# Altium schematic sheet PWM.SchDoc
size 420 x 297 mm; SheetNumber: 6; SheetTotal: 7
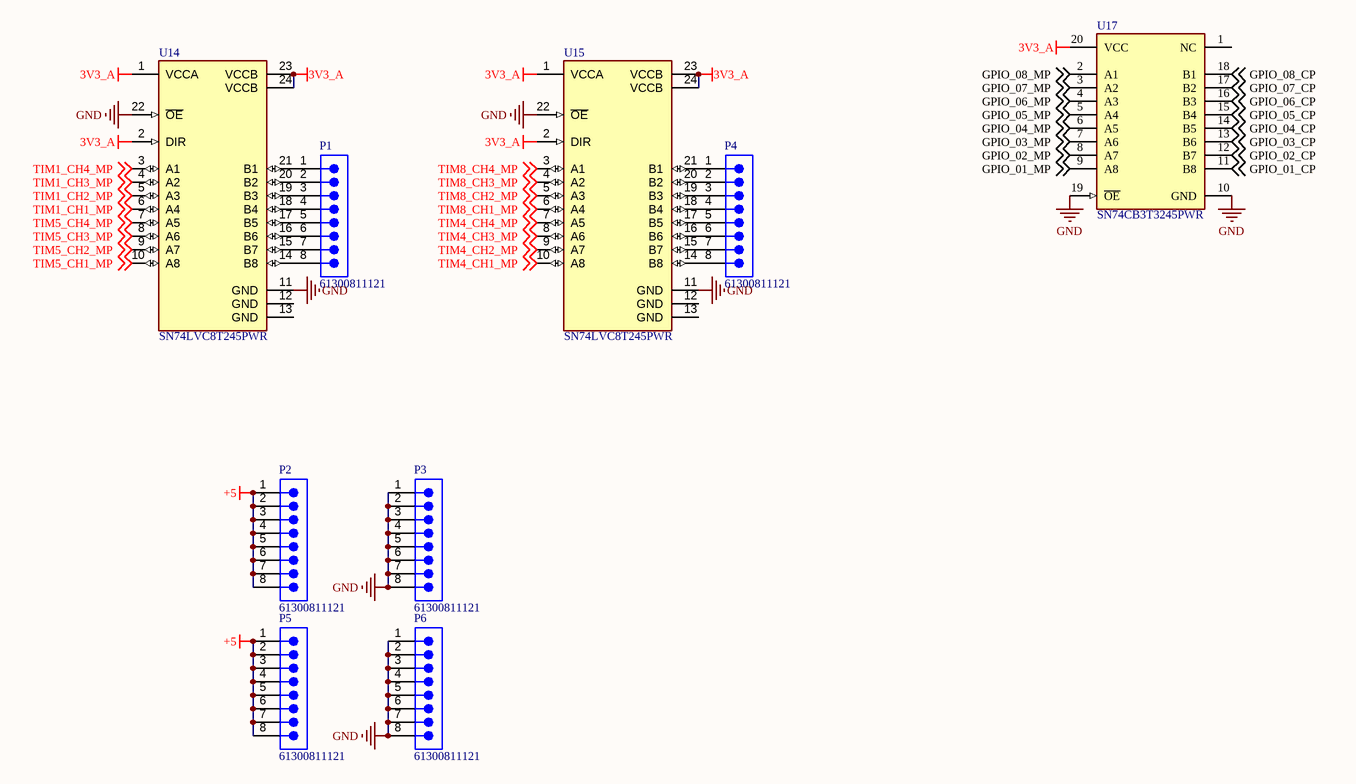
[diagram p0: PWM.SchDoc]

## Parts
P1  61300811121  [61300811121]
P2  61300811121  [61300811121]
P3  61300811121  [61300811121]
P4  61300811121  [61300811121]
P5  61300811121  [61300811121]
P6  61300811121  [61300811121]
U14  SN74LVC8T245PWR  [FP-PW0024A-MFG]
U15  SN74LVC8T245PWR  [FP-PW0024A-MFG]
U17  SN74CB3T3245PWR  [FP-PW0020A-MFG]

## Nets
3V3_A: U14.1(VCCA) U14.2(DIR) U14.23(VCCB) U14.24(VCCB) U15.1(VCCA) U15.2(DIR) U15.23(VCCB) U15.24(VCCB) U17.20(VCC)
+5: P2.1 P2.2 P2.3 P2.4 P2.5 P2.6 P2.7 P2.8 P5.1 P5.2 P5.3 P5.4 P5.5 P5.6 P5.7 P5.8
GND: P3.1 P3.2 P3.3 P3.4 P3.5 P3.6 P3.7 P3.8 P6.1 P6.2 P6.3 P6.4 P6.5 P6.6 P6.7 P6.8 U14.11(GND) U14.22(~{OE}) U15.11(GND) U15.22(~{OE}) U17.10(GND) U17.19(~{OE})
GPIO_01_CP: U17.11(B8) ; off-sheet GPIO_01_CP
GPIO_01_MP: U17.9(A8) ; off-sheet GPIO_01_MP
GPIO_02_CP: U17.12(B7) ; off-sheet GPIO_02_CP
GPIO_02_MP: U17.8(A7) ; off-sheet GPIO_02_MP
GPIO_03_CP: U17.13(B6) ; off-sheet GPIO_03_CP
GPIO_03_MP: U17.7(A6) ; off-sheet GPIO_03_MP
GPIO_04_CP: U17.14(B5) ; off-sheet GPIO_04_CP
GPIO_04_MP: U17.6(A5) ; off-sheet GPIO_04_MP
GPIO_05_CP: U17.15(B4) ; off-sheet GPIO_05_CP
GPIO_05_MP: U17.5(A4) ; off-sheet GPIO_05_MP
GPIO_06_CP: U17.16(B3) ; off-sheet GPIO_06_CP
GPIO_06_MP: U17.4(A3) ; off-sheet GPIO_06_MP
GPIO_07_CP: U17.17(B2) ; off-sheet GPIO_07_CP
GPIO_07_MP: U17.3(A2) ; off-sheet GPIO_07_MP
GPIO_08_CP: U17.18(B1) ; off-sheet GPIO_08_CP
GPIO_08_MP: U17.2(A1) ; off-sheet GPIO_08_MP
TIM1_CH1_MP: U14.6(A4) ; off-sheet TIM1_CH1_MP
TIM1_CH2_MP: U14.5(A3) ; off-sheet TIM1_CH2_MP
TIM1_CH3_MP: U14.4(A2) ; off-sheet TIM1_CH3_MP
TIM1_CH4_MP: U14.3(A1) ; off-sheet TIM1_CH4_MP
TIM4_CH1_MP: U15.10(A8) ; off-sheet TIM4_CH1_MP
TIM4_CH2_MP: U15.9(A7) ; off-sheet TIM4_CH2_MP
TIM4_CH3_MP: U15.8(A6) ; off-sheet TIM4_CH3_MP
TIM4_CH4_MP: U15.7(A5) ; off-sheet TIM4_CH4_MP
TIM5_CH1_MP: U14.10(A8) ; off-sheet TIM5_CH1_MP
TIM5_CH2_MP: U14.9(A7) ; off-sheet TIM5_CH2_MP
TIM5_CH3_MP: U14.8(A6) ; off-sheet TIM5_CH3_MP
TIM5_CH4_MP: U14.7(A5) ; off-sheet TIM5_CH4_MP
TIM8_CH1_MP: U15.6(A4) ; off-sheet TIM8_CH1_MP
TIM8_CH2_MP: U15.5(A3) ; off-sheet TIM8_CH2_MP
TIM8_CH3_MP: U15.4(A2) ; off-sheet TIM8_CH3_MP
TIM8_CH4_MP: U15.3(A1) ; off-sheet TIM8_CH4_MP
NetP1_1: P1.1 U14.21(B1)
NetP1_2: P1.2 U14.20(B2)
NetP1_3: P1.3 U14.19(B3)
NetP1_4: P1.4 U14.18(B4)
NetP1_5: P1.5 U14.17(B5)
NetP1_6: P1.6 U14.16(B6)
NetP1_7: P1.7 U14.15(B7)
NetP1_8: P1.8 U14.14(B8)
NetP4_1: P4.1 U15.21(B1)
NetP4_2: P4.2 U15.20(B2)
NetP4_3: P4.3 U15.19(B3)
NetP4_4: P4.4 U15.18(B4)
NetP4_5: P4.5 U15.17(B5)
NetP4_6: P4.6 U15.16(B6)
NetP4_7: P4.7 U15.15(B7)
NetP4_8: P4.8 U15.14(B8)

Not connected (* = marked no-connect by the designer): U14 12(GND) 13(GND); U15 12(GND) 13(GND); U17 1(NC)

## Notes on the sheet
- THIS DOCUMENT AND THE DATA DISCLOSED HEREIN OR
- HEREWITH IS THE PROPERTY OF ALTIUM LIMITED AND MAY
- DWG NO:
- REVISION
- REV:
- DESCRIPTION
- DATE
- APPROVED
- BE FREELY DISTRIBUTED IN WHOLE. NO RIGHTS ARE
- RESERVED OR EXPRESS OR IMPLIED WARANTEE GIVEN.
- ENG:
- APPROVALS
- PROJECT
- DSN:
- CHK:
- REFERENCE DOCUMENTS
- PROJECT REVISION:
- TITLE
- DOCUMENT REVISION:
- DESIGN ITEM:
- BOM:
- FAB DWG:
- PCB DWG:
- ASSY DWG:
- SCALE:
- A3
- SIZE
- CAGE CODE
- FILE NAME
- DWG NO.
- SHEET
- OF
- REV

## Library data of the parts
P1-P6 = CMP-1502-01076-3: NexarPartId: 32855533; Connector Type: Male Pin; Number of Contacts: 8; Voltage Rating: 250V; Current Rating: 3A; Contact Resistance: 20mΩ; Pitch: 2.54mm; Gender: Male; Termination: Solder; Contact Material: Copper; Mount: Through Hole; Lead Pitch: 2.54mm; Number of Positions: 8; Operating Supply Voltage: 250V; Number of Pins: 8; Max Operating Temperature: 105°C; Height: 8.54mm; REACH SVHC: Unknown; Number of Rows: 1; Packaging: Bulk; Contact Plating: Gold; Contact Mating Length: 5.9944mm; Orientation: Vertical; RoHS: Compliant; Color: Black; Min Operating Temperature: -40°C
U14 U15 = CMP-04899-000027-1: IC TRNSLTR BIDIRECTIONAL 24TSSOP; Manufacturer: Texas Instruments; V B Min: 1.65V; V B Max: 5.5V; Number Of Outputs: 8; Standoff Height: 0.05mm; Nominal Supply Current: 25uA; Number Of Circuits: 1; Propagation Delay: 4.3ns; Logic Function Desc: Non-Inverting; Ambient Temperature Range High: +85°C; Temperature Range Low: -40°C; Category: IC; Min Supply Voltage: 1.65V; Device Class L2: Logic ICs; Digikey Description: IC TRNSLTR BIDIRECTIONAL 24TSSOP; ComponentLink2Description: Datasheet; V A Min: 1.65V; Height: 1.2mm; Device Class L1: Integrated Circuits (ICs); Manufacturer Part Number: SN74LVC8T245PWR; Ipc Land Pattern Name: SOP65P640X120-24; Lead Free: Yes; Device Class L3: Voltage Level Shifters; Octopart: https://octopart.com/sn74lvc8t245pwr-texas+instruments-517164; RoHS: TRUE; Ambient Temperature Range Low: -40°C; Number Of Inputs: 8; Automotive: No; V A Max: 5.5V; Mouser Description: Translation - Voltage Levels 8-Bit Dual-Supply Bus Xcvr; Temperature Range High: +85°C; ComponentLink2URL: http://www.ti.com/lit/ds/symlink/sn74lvc8t245.pdf; Temperature: -40°C to +85°C; Package: PW0024A; Max Supply Voltage: 5.5V
U17 = CMP-0775-00065-4: IC 2.5/3.3V FET BUS SW 20-TSSOP; Number of Bits: 8; Low Level Output Current: 128mA; Max Supply Voltage: 3.6V; Bandwidth: 100MHz; Polarity: Non-Inverting; Number of Elements: 1; High Level Output Current: -128mA; Supply Type: Single; Propagation Delay: 10.5ns; Quiescent Current: 40uA; Output Current: 64mA; On-State Resistance: 8.5R; Min Supply Voltage: 2.3V; Throw Configuration: SPST; Case/Package: TSSOP; Package Quantity: 1; Technology: CMOS; Number of Switches: 8; Weight: 0.002716oz; Contact Plating: Gold; Series: 74CB; Mount: Surface Mount; Min Operating Temperature: -40°C; RoHS Compliant: Yes; Radiation Hardening: No; Packaging: Tape and Reel; Independent Circuits: 1; Supply Current: 40uA; Turn-On Delay Time: 10.5ns; Nominal Supply Current: 40uA; Number of Channels: 8; Lead Free: Lead Free; Max Operating Temperature: 85°C; Number of Pins: 20